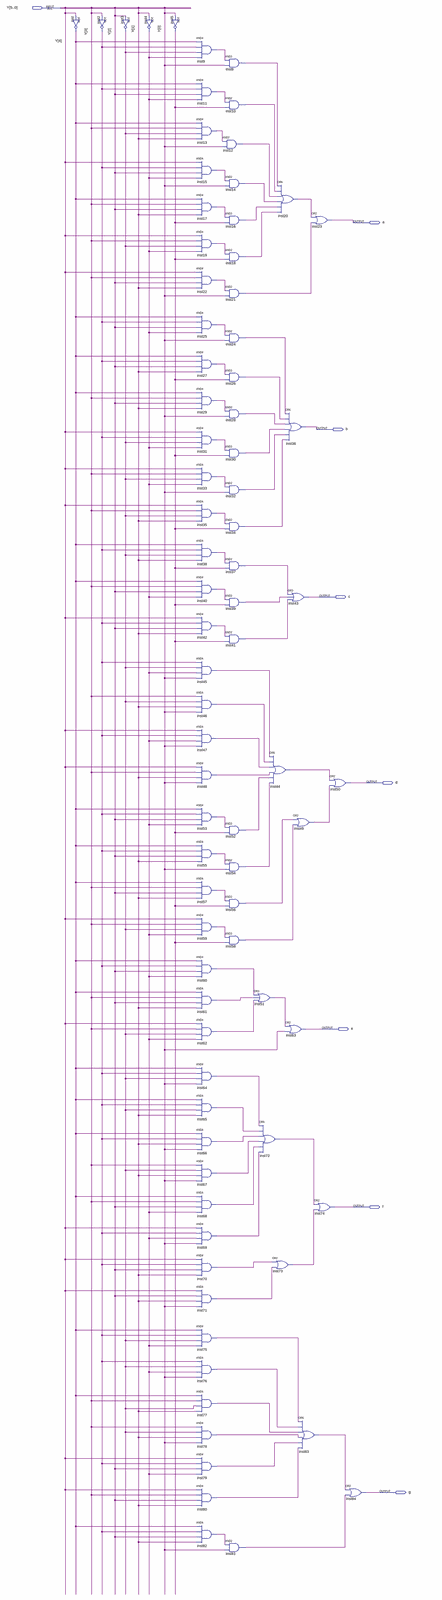
[diagram p0: schematic sheet, whole]
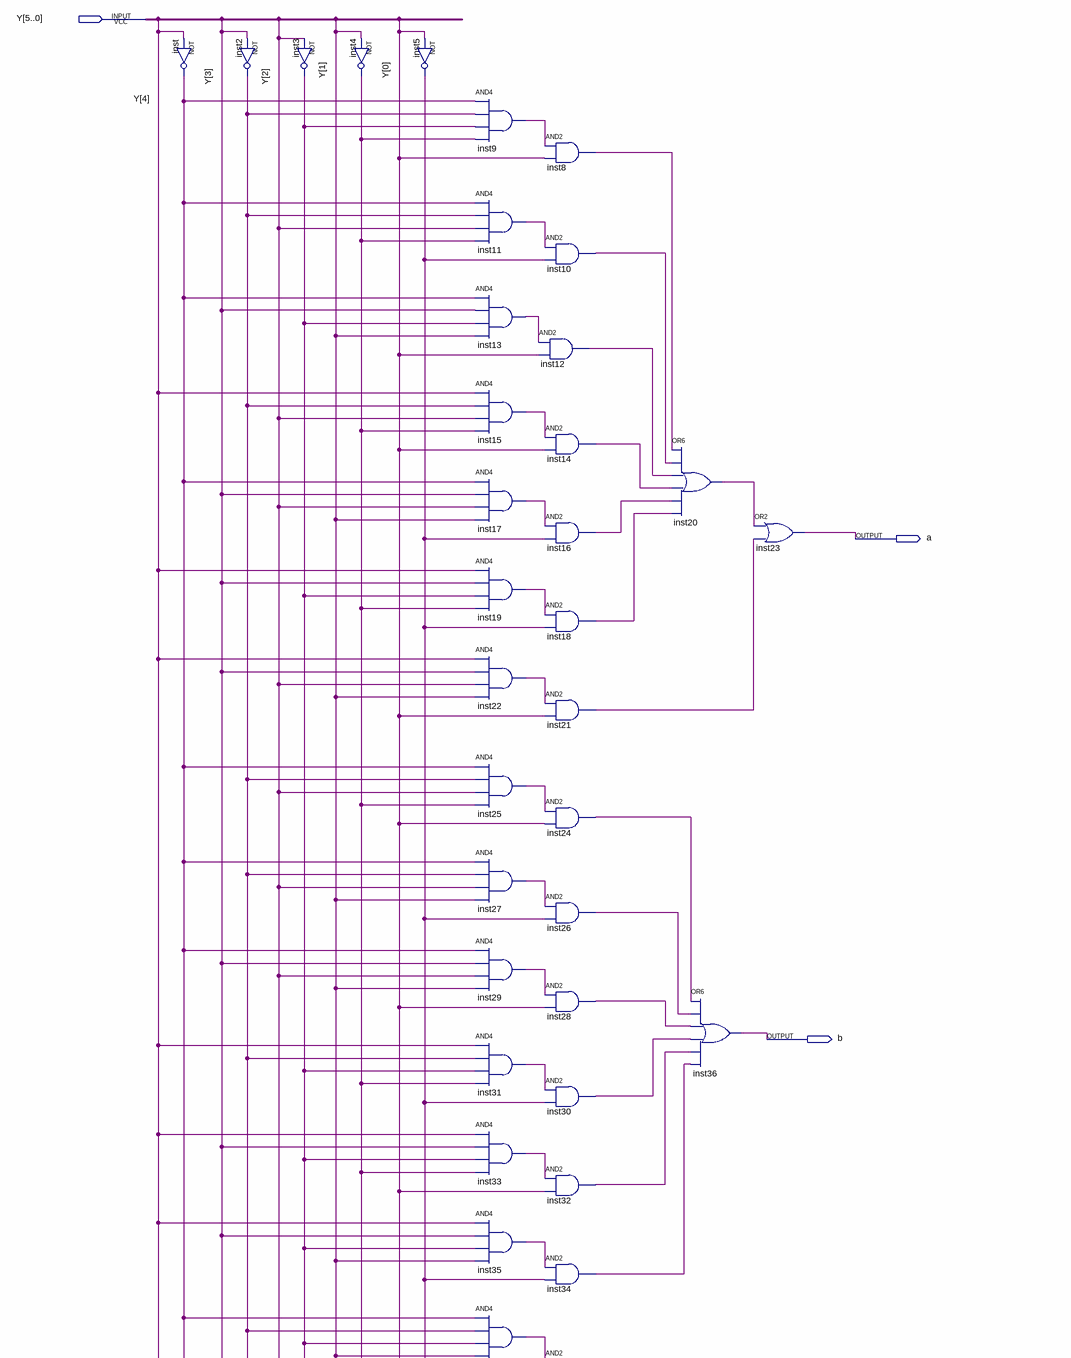
[diagram p1: schematic sheet, upper part]
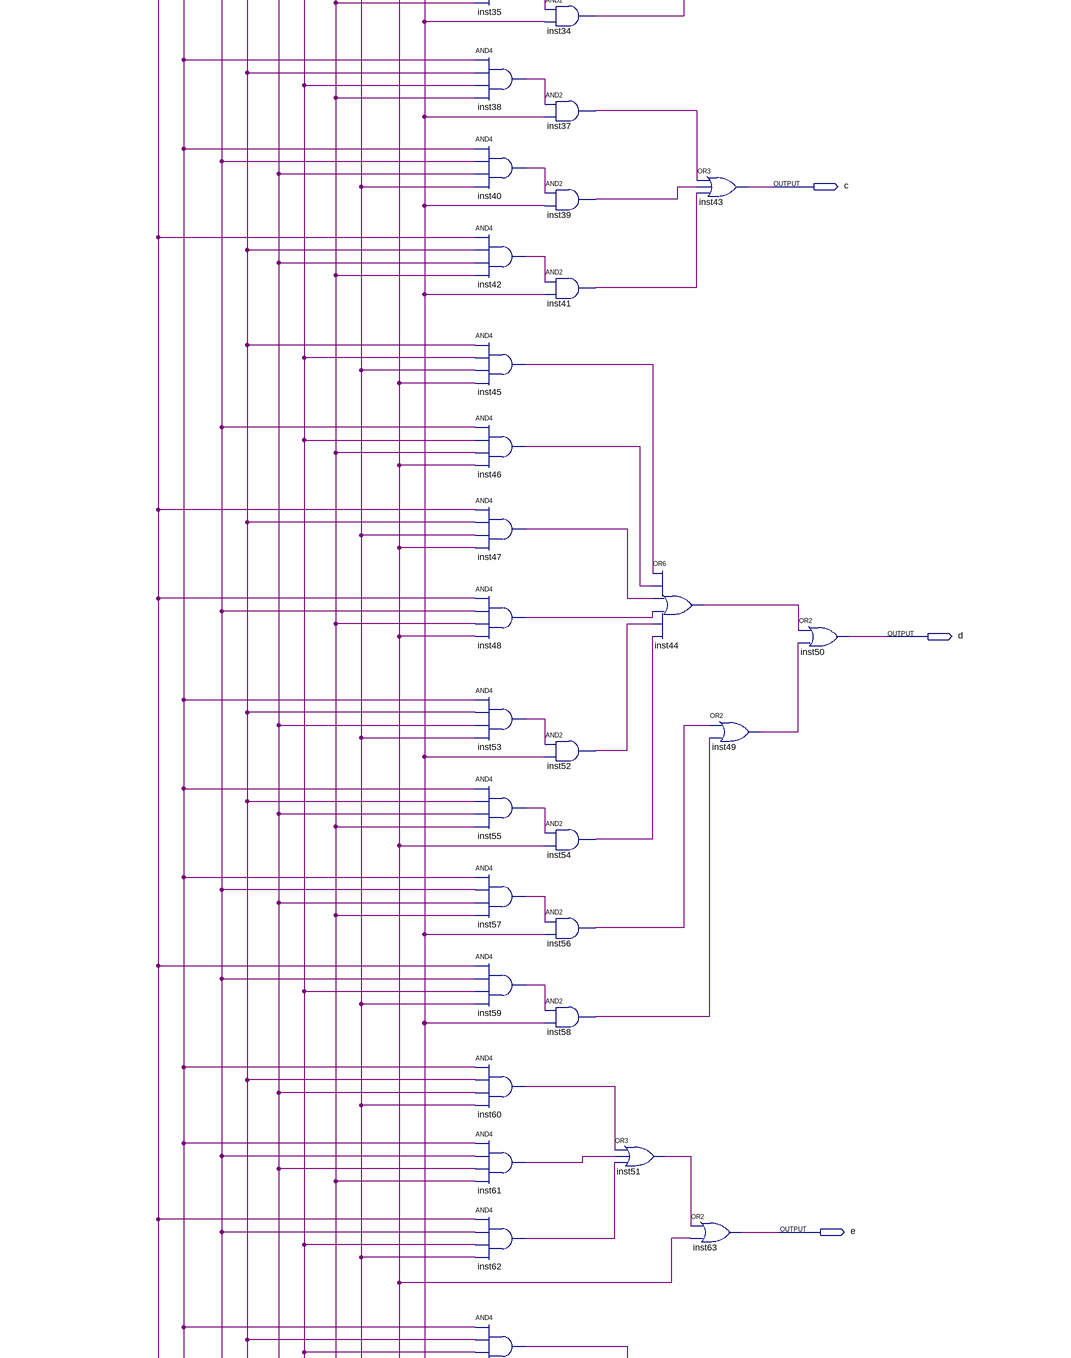
[diagram p2: schematic sheet, middle part]
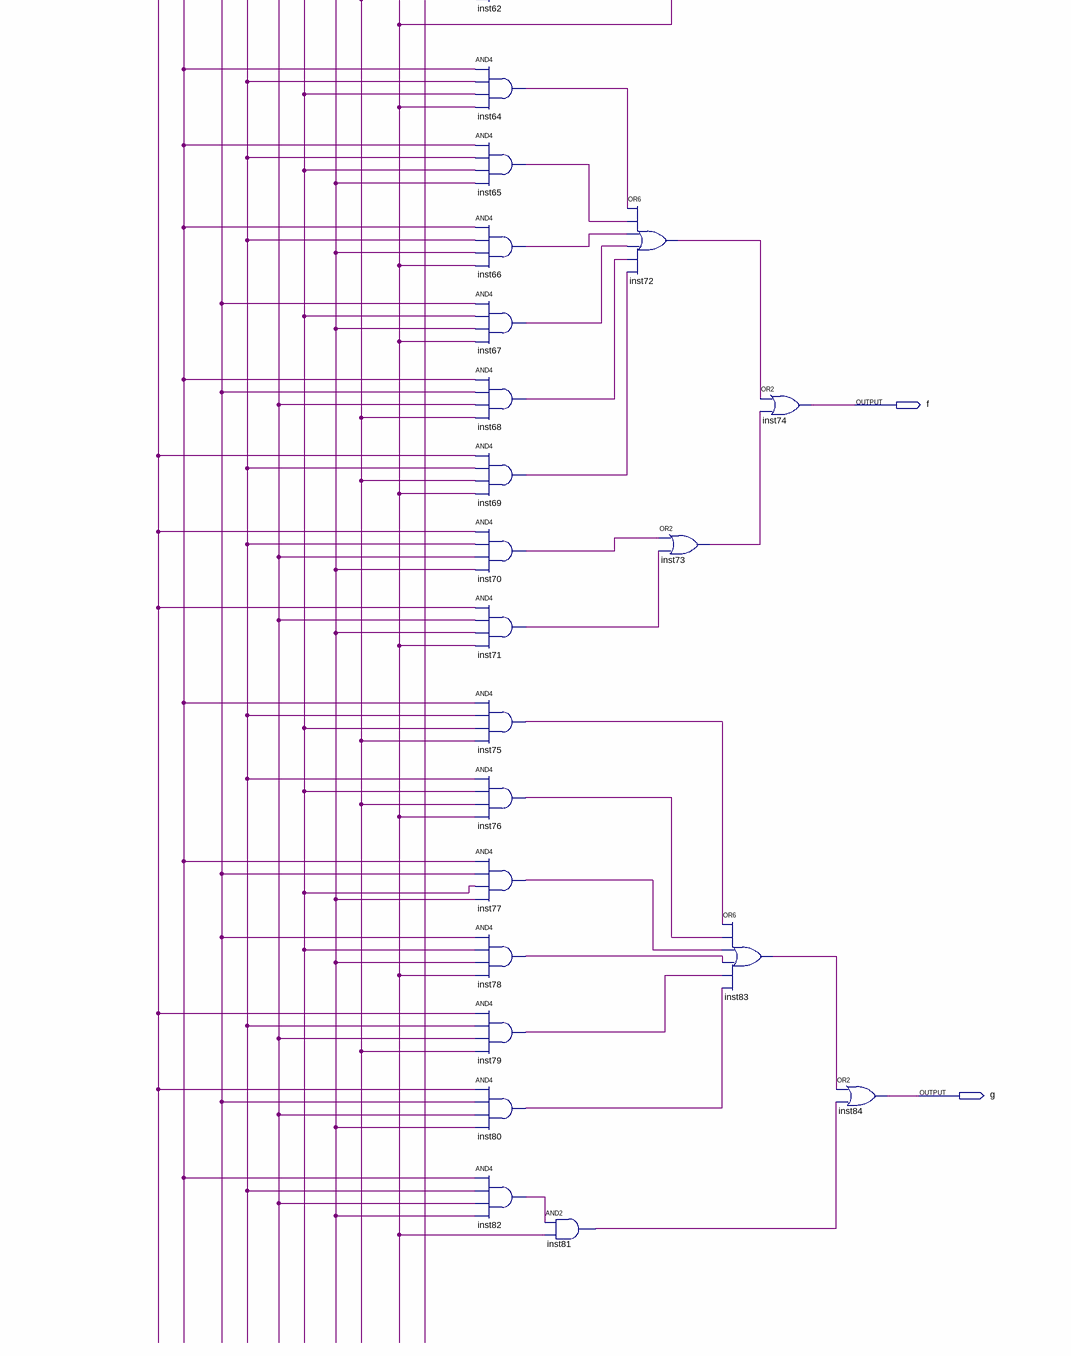
[diagram p3: schematic sheet, lower part]
// Quartus schematic BCDunidades.bdf as structural Verilog: 82 symbols, 8 pins
module BCDunidades (
  input  [5:0] Y,
  output a,
  output b,
  output c,
  output d,
  output e,
  output f,
  output g
);

  wire inst2_out, inst3_out, inst4_out, inst5_out, inst8_out, inst9_out, inst10_out, inst11_out, inst12_out,
       inst13_out, inst14_out, inst15_out, inst16_out, inst17_out, inst18_out, inst19_out, inst20_out,
       inst21_out, inst22_out, inst24_out, inst25_out, inst26_out, inst27_out, inst28_out, inst29_out,
       inst30_out, inst31_out, inst32_out, inst33_out, inst34_out, inst35_out, inst37_out, inst38_out,
       inst39_out, inst40_out, inst41_out, inst42_out, inst44_out, inst45_out, inst46_out, inst47_out,
       inst48_out, inst49_out, inst51_out, inst52_out, inst53_out, inst54_out, inst55_out, inst56_out,
       inst57_out, inst58_out, inst59_out, inst60_out, inst61_out, inst62_out, inst64_out, inst65_out,
       inst66_out, inst67_out, inst68_out, inst69_out, inst70_out, inst71_out, inst72_out, inst73_out,
       inst75_out, inst76_out, inst77_out, inst78_out, inst79_out, inst80_out, inst81_out, inst82_out,
       inst83_out, inst_out;

  not inst (inst_out, Y[4]);
  not inst2 (inst2_out, Y[3]);
  not inst3 (inst3_out, Y[2]);
  not inst4 (inst4_out, Y[1]);
  not inst5 (inst5_out, Y[0]);
  and inst9 (inst9_out, inst_out, inst2_out, inst3_out, inst4_out);
  and inst11 (inst11_out, inst_out, inst2_out, Y[2], inst4_out);
  and inst13 (inst13_out, inst_out, Y[3], inst3_out, Y[1]);
  and inst15 (inst15_out, Y[4], inst2_out, Y[2], inst4_out);
  and inst17 (inst17_out, inst_out, Y[3], Y[2], Y[1]);
  and inst19 (inst19_out, Y[4], Y[3], inst3_out, inst4_out);
  and inst22 (inst22_out, Y[4], Y[3], Y[2], Y[1]);
  and inst25 (inst25_out, inst_out, inst2_out, Y[2], inst4_out);
  and inst27 (inst27_out, inst_out, inst2_out, Y[2], Y[1]);
  and inst29 (inst29_out, inst_out, Y[3], Y[2], Y[1]);
  and inst31 (inst31_out, Y[4], inst2_out, inst3_out, inst4_out);
  and inst33 (inst33_out, Y[4], Y[3], inst3_out, inst4_out);
  and inst35 (inst35_out, Y[4], Y[3], inst3_out, Y[1]);
  and inst38 (inst38_out, inst_out, inst2_out, inst3_out, Y[1]);
  and inst40 (inst40_out, inst_out, Y[3], Y[2], inst4_out);
  and inst42 (inst42_out, Y[4], inst2_out, Y[2], Y[1]);
  and inst45 (inst45_out, inst2_out, inst3_out, inst4_out, Y[0]);
  and inst46 (inst46_out, Y[3], inst3_out, Y[1], Y[0]);
  and inst47 (inst47_out, Y[4], inst2_out, inst4_out, Y[0]);
  and inst48 (inst48_out, Y[4], Y[3], Y[1], Y[0]);
  and inst53 (inst53_out, inst_out, inst2_out, Y[2], inst4_out);
  and inst55 (inst55_out, inst_out, inst2_out, Y[2], Y[1]);
  and inst57 (inst57_out, inst_out, Y[3], Y[2], Y[1]);
  and inst59 (inst59_out, Y[4], Y[3], inst3_out, inst4_out);
  and inst60 (inst60_out, inst_out, inst2_out, Y[2], inst4_out);
  and inst61 (inst61_out, inst_out, Y[3], Y[2], Y[1]);
  and inst62 (inst62_out, Y[4], Y[3], inst3_out, inst4_out);
  and inst64 (inst64_out, inst_out, inst2_out, inst3_out, Y[0]);
  and inst65 (inst65_out, inst_out, inst2_out, inst3_out, Y[1]);
  and inst66 (inst66_out, inst_out, inst2_out, Y[1], Y[0]);
  and inst67 (inst67_out, Y[3], inst3_out, Y[1], Y[0]);
  and inst68 (inst68_out, inst_out, Y[3], Y[2], inst4_out);
  and inst69 (inst69_out, Y[4], inst2_out, inst4_out, Y[0]);
  and inst70 (inst70_out, Y[4], inst2_out, Y[2], Y[1]);
  and inst71 (inst71_out, Y[4], Y[2], Y[1], Y[0]);
  and inst75 (inst75_out, inst_out, inst2_out, inst3_out, inst4_out);
  and inst76 (inst76_out, inst2_out, inst3_out, inst4_out, Y[0]);
  and inst77 (inst77_out, inst_out, Y[3], inst3_out, Y[1]);
  and inst78 (inst78_out, Y[3], inst3_out, Y[1], Y[0]);
  and inst79 (inst79_out, Y[4], inst2_out, Y[2], inst4_out);
  and inst80 (inst80_out, Y[4], Y[3], Y[2], Y[1]);
  and inst82 (inst82_out, inst_out, inst2_out, Y[2], Y[1]);
  and inst8 (inst8_out, inst9_out, Y[0]);
  and inst10 (inst10_out, inst11_out, inst5_out);
  and inst12 (inst12_out, inst13_out, Y[0]);
  and inst14 (inst14_out, inst15_out, Y[0]);
  and inst16 (inst16_out, inst17_out, inst5_out);
  and inst18 (inst18_out, inst19_out, inst5_out);
  and inst21 (inst21_out, inst22_out, Y[0]);
  and inst24 (inst24_out, inst25_out, Y[0]);
  and inst26 (inst26_out, inst27_out, inst5_out);
  and inst28 (inst28_out, inst29_out, Y[0]);
  and inst30 (inst30_out, inst31_out, inst5_out);
  and inst32 (inst32_out, inst33_out, Y[0]);
  and inst34 (inst34_out, inst35_out, inst5_out);
  and inst37 (inst37_out, inst38_out, inst5_out);
  and inst39 (inst39_out, inst40_out, inst5_out);
  and inst41 (inst41_out, inst42_out, inst5_out);
  and inst52 (inst52_out, inst53_out, inst5_out);
  and inst54 (inst54_out, inst55_out, Y[0]);
  and inst56 (inst56_out, inst57_out, inst5_out);
  and inst58 (inst58_out, inst59_out, inst5_out);
  and inst81 (inst81_out, inst82_out, Y[0]);
  or inst51 (inst51_out, inst60_out, inst61_out, inst62_out);
  or inst72 (inst72_out, inst64_out, inst65_out, inst66_out, inst67_out, inst68_out, inst69_out);
  or inst20 (inst20_out, inst8_out, inst10_out, inst12_out, inst14_out, inst16_out, inst18_out);
  or inst36 (b, inst24_out, inst26_out, inst28_out, inst30_out, inst32_out, inst34_out);
  or inst43 (c, inst37_out, inst39_out, inst41_out);
  or inst44 (inst44_out, inst45_out, inst46_out, inst47_out, inst48_out, inst52_out, inst54_out);
  or inst63 (e, inst51_out, Y[0]);
  or inst73 (inst73_out, inst70_out, inst71_out);
  or inst49 (inst49_out, inst56_out, inst58_out);
  or inst83 (inst83_out, inst75_out, inst76_out, inst77_out, inst78_out, inst79_out, inst80_out);
  or inst23 (a, inst20_out, inst21_out);
  or inst50 (d, inst44_out, inst49_out);
  or inst74 (f, inst72_out, inst73_out);
  or inst84 (g, inst83_out, inst81_out);
endmodule
